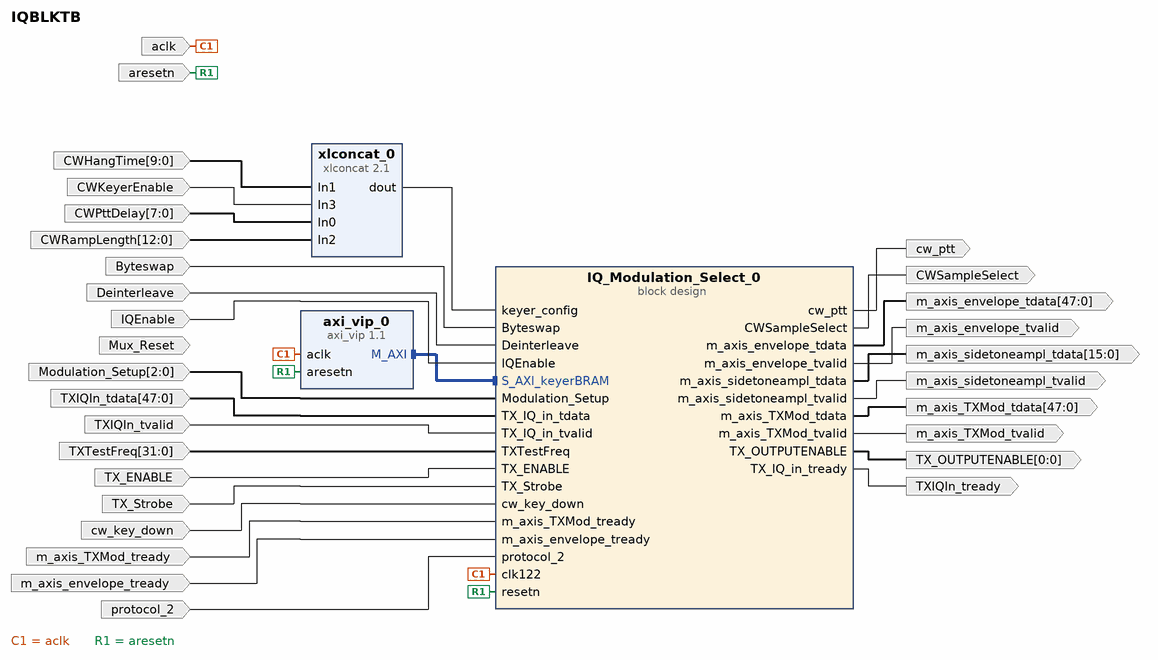
[diagram p0: block diagram of the top level]
# Vivado block design IQBLKTB, xc7a200tfbg676-2, Vivado 2023.1
create_bd_design IQBLKTB

create_bd_port -dir I -from 47 -to 0 TXIQIn_tdata
create_bd_port -dir I TXIQIn_tvalid
create_bd_port -dir I Byteswap
create_bd_port -dir I Deinterleave
create_bd_port -dir I IQEnable
create_bd_port -dir I -from 2 -to 0 Modulation_Setup
create_bd_port -dir I Mux_Reset
create_bd_port -dir I -from 31 -to 0 TXTestFreq
create_bd_port -dir I TX_Strobe
create_bd_port -dir I TX_ENABLE
create_bd_port -dir I cw_key_down
create_bd_port -dir I protocol_2
create_bd_port -dir O CWSampleSelect
create_bd_port -dir O -from 0 -to 0 TX_OUTPUTENABLE
create_bd_port -dir O cw_ptt
create_bd_port -dir O TXIQIn_tready
create_bd_port -dir I -type clk aclk
set_property -dict {CONFIG.FREQ_HZ 122880000} [get_bd_ports aclk]
create_bd_port -dir I -type rst aresetn
create_bd_port -dir I -from 7 -to 0 CWPttDelay
create_bd_port -dir I -from 9 -to 0 CWHangTime
create_bd_port -dir I -from 12 -to 0 CWRampLength
create_bd_port -dir I CWKeyerEnable
create_bd_port -dir O -from 47 -to 0 m_axis_TXMod_tdata
create_bd_port -dir O m_axis_TXMod_tvalid
create_bd_port -dir I m_axis_TXMod_tready
create_bd_port -dir O -from 47 -to 0 m_axis_envelope_tdata
create_bd_port -dir O m_axis_envelope_tvalid
create_bd_port -dir I m_axis_envelope_tready
create_bd_port -dir O -from 15 -to 0 m_axis_sidetoneampl_tdata
create_bd_port -dir O m_axis_sidetoneampl_tvalid

create_bd_cell -type ip -vlnv xilinx.com:ip:xlconcat:2.1 xlconcat_0
set_property -dict [list \
  CONFIG.IN0_WIDTH 8 \
  CONFIG.IN1_WIDTH 10 \
  CONFIG.IN2_WIDTH 13 \
  CONFIG.IN3_WIDTH 1 \
  CONFIG.NUM_PORTS 4 \
] [get_bd_cells xlconcat_0]
create_bd_cell -type container -reference IQ_Modulation_Select IQ_Modulation_Select_0
set_property -dict [list \
  CONFIG.ACTIVE_SIM_BD IQ_Modulation_Select.bd \
  CONFIG.ACTIVE_SYNTH_BD IQ_Modulation_Select.bd \
  CONFIG.ENABLE_DFX 0 \
  CONFIG.LIST_SIM_BD IQ_Modulation_Select.bd \
  CONFIG.LIST_SYNTH_BD IQ_Modulation_Select.bd \
  CONFIG.LOCK_PROPAGATE 0 \
] [get_bd_cells IQ_Modulation_Select_0]
create_bd_cell -type ip -vlnv xilinx.com:ip:axi_vip:1.1 axi_vip_0
set_property -dict [list \
  CONFIG.ADDR_WIDTH 32 \
  CONFIG.ARUSER_WIDTH 0 \
  CONFIG.AWUSER_WIDTH 0 \
  CONFIG.BUSER_WIDTH 0 \
  CONFIG.DATA_WIDTH 32 \
  CONFIG.HAS_BRESP 1 \
  CONFIG.HAS_BURST 1 \
  CONFIG.HAS_CACHE 1 \
  CONFIG.HAS_LOCK 1 \
  CONFIG.HAS_PROT 1 \
  CONFIG.HAS_QOS 1 \
  CONFIG.HAS_REGION 1 \
  CONFIG.HAS_RRESP 1 \
  CONFIG.HAS_WSTRB 1 \
  CONFIG.ID_WIDTH 0 \
  CONFIG.INTERFACE_MODE MASTER \
  CONFIG.PROTOCOL AXI4 \
  CONFIG.READ_WRITE_MODE READ_WRITE \
  CONFIG.RUSER_WIDTH 0 \
  CONFIG.SUPPORTS_NARROW 1 \
  CONFIG.WUSER_WIDTH 0 \
] [get_bd_cells axi_vip_0]

# ---- connections ----

connect_bd_intf_net [get_bd_intf_pins axi_vip_0/M_AXI] [get_bd_intf_pins IQ_Modulation_Select_0/S_AXI_keyerBRAM]
connect_bd_net [get_bd_ports Byteswap] [get_bd_pins IQ_Modulation_Select_0/Byteswap]
connect_bd_net [get_bd_ports CWHangTime] [get_bd_pins xlconcat_0/In1]
connect_bd_net [get_bd_ports CWKeyerEnable] [get_bd_pins xlconcat_0/In3]
connect_bd_net [get_bd_ports CWPttDelay] [get_bd_pins xlconcat_0/In0]
connect_bd_net [get_bd_ports CWRampLength] [get_bd_pins xlconcat_0/In2]
connect_bd_net [get_bd_ports Deinterleave] [get_bd_pins IQ_Modulation_Select_0/Deinterleave]
connect_bd_net [get_bd_ports IQEnable] [get_bd_pins IQ_Modulation_Select_0/IQEnable]
connect_bd_net [get_bd_pins IQ_Modulation_Select_0/CWSampleSelect] [get_bd_ports CWSampleSelect]
connect_bd_net [get_bd_pins IQ_Modulation_Select_0/TX_IQ_in_tready] [get_bd_ports TXIQIn_tready]
connect_bd_net [get_bd_pins IQ_Modulation_Select_0/TX_OUTPUTENABLE] [get_bd_ports TX_OUTPUTENABLE]
connect_bd_net [get_bd_pins IQ_Modulation_Select_0/cw_ptt] [get_bd_ports cw_ptt]
connect_bd_net [get_bd_pins IQ_Modulation_Select_0/m_axis_TXMod_tdata] [get_bd_ports m_axis_TXMod_tdata]
connect_bd_net [get_bd_pins IQ_Modulation_Select_0/m_axis_TXMod_tvalid] [get_bd_ports m_axis_TXMod_tvalid]
connect_bd_net [get_bd_pins IQ_Modulation_Select_0/m_axis_envelope_tdata] [get_bd_ports m_axis_envelope_tdata]
connect_bd_net [get_bd_pins IQ_Modulation_Select_0/m_axis_envelope_tvalid] [get_bd_ports m_axis_envelope_tvalid]
connect_bd_net [get_bd_pins IQ_Modulation_Select_0/m_axis_sidetoneampl_tdata] [get_bd_ports m_axis_sidetoneampl_tdata]
connect_bd_net [get_bd_pins IQ_Modulation_Select_0/m_axis_sidetoneampl_tvalid] [get_bd_ports m_axis_sidetoneampl_tvalid]
connect_bd_net [get_bd_ports Modulation_Setup] [get_bd_pins IQ_Modulation_Select_0/Modulation_Setup]
# net Mux_Reset_1 has one end: Mux_Reset
connect_bd_net [get_bd_ports TXIQIn_tdata] [get_bd_pins IQ_Modulation_Select_0/TX_IQ_in_tdata]
connect_bd_net [get_bd_ports TXIQIn_tvalid] [get_bd_pins IQ_Modulation_Select_0/TX_IQ_in_tvalid]
connect_bd_net [get_bd_ports TXTestFreq] [get_bd_pins IQ_Modulation_Select_0/TXTestFreq]
connect_bd_net [get_bd_ports TX_ENABLE] [get_bd_pins IQ_Modulation_Select_0/TX_ENABLE]
connect_bd_net [get_bd_ports TX_Strobe] [get_bd_pins IQ_Modulation_Select_0/TX_Strobe]
connect_bd_net -net clk122_1 [get_bd_ports aclk] [get_bd_pins IQ_Modulation_Select_0/clk122] [get_bd_pins axi_vip_0/aclk]
connect_bd_net [get_bd_ports cw_key_down] [get_bd_pins IQ_Modulation_Select_0/cw_key_down]
connect_bd_net [get_bd_ports m_axis_TXMod_tready] [get_bd_pins IQ_Modulation_Select_0/m_axis_TXMod_tready]
connect_bd_net [get_bd_ports m_axis_envelope_tready] [get_bd_pins IQ_Modulation_Select_0/m_axis_envelope_tready]
connect_bd_net -net protocol_2_1 [get_bd_ports protocol_2] [get_bd_pins IQ_Modulation_Select_0/protocol_2]
connect_bd_net -net resetn_1 [get_bd_ports aresetn] [get_bd_pins IQ_Modulation_Select_0/resetn] [get_bd_pins axi_vip_0/aresetn]
connect_bd_net [get_bd_pins xlconcat_0/dout] [get_bd_pins IQ_Modulation_Select_0/keyer_config]

# ---- address map ----
assign_bd_address -offset 0x001C0000 -range 8K -target_address_space [get_bd_addr_spaces axi_vip_0/Master_AXI] [get_bd_addr_segs IQ_Modulation_Select_0/axi_bram_ctrl_0/S_AXI/Mem0]

validate_bd_design
save_bd_design
